# Altium schematic sheet TOP_Design.SchDoc
size A4
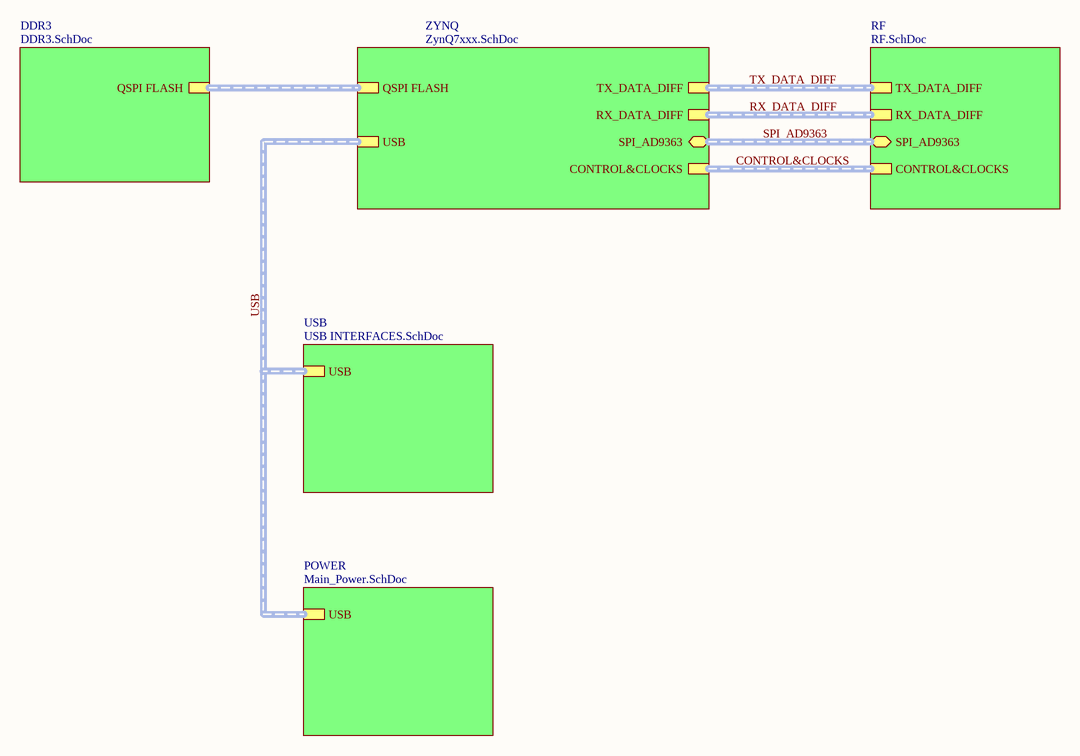
[diagram p0: TOP_Design.SchDoc]

## Sub-sheets
DDR3 = DDR3.SchDoc: QSPI FLASH (harness QSPI)
POWER = Main_Power.SchDoc: USB (harness QSPI)
RF = RF.SchDoc: TX_DATA_DIFF (harness TX_DATA), RX_DATA_DIFF (harness TX_DATA), SPI_AD9363 (bidir, harness SPI), CONTROL&CLOCKS (harness CONTROL&CLOCKS)
USB = USB INTERFACES.SchDoc: USB (harness QSPI)
ZYNQ = ZynQ7xxx.SchDoc: TX_DATA_DIFF (harness TX_DATA), RX_DATA_DIFF (harness TX_DATA), QSPI FLASH (harness QSPI), USB (harness QSPI), SPI_AD9363 (bidir, harness SPI), CONTROL&CLOCKS (harness CONTROL&CLOCKS)

## Buses and harness runs
harness CONTROL&CLOCKS = sheet RF/CONTROL&CLOCKS = sheet ZYNQ/CONTROL&CLOCKS
harness RX_DATA_DIFF = sheet RF/RX_DATA_DIFF = sheet ZYNQ/RX_DATA_DIFF
harness sheet DDR3/QSPI FLASH = sheet ZYNQ/QSPI FLASH
harness SPI_AD9363 = sheet RF/SPI_AD9363 = sheet ZYNQ/SPI_AD9363
harness TX_DATA_DIFF = sheet RF/TX_DATA_DIFF = sheet ZYNQ/TX_DATA_DIFF
harness USB = sheet POWER/USB = sheet USB/USB = sheet ZYNQ/USB